# Altium schematic sheet Main.SchDoc
size A; SheetNumber: 1; SheetTotal: 3
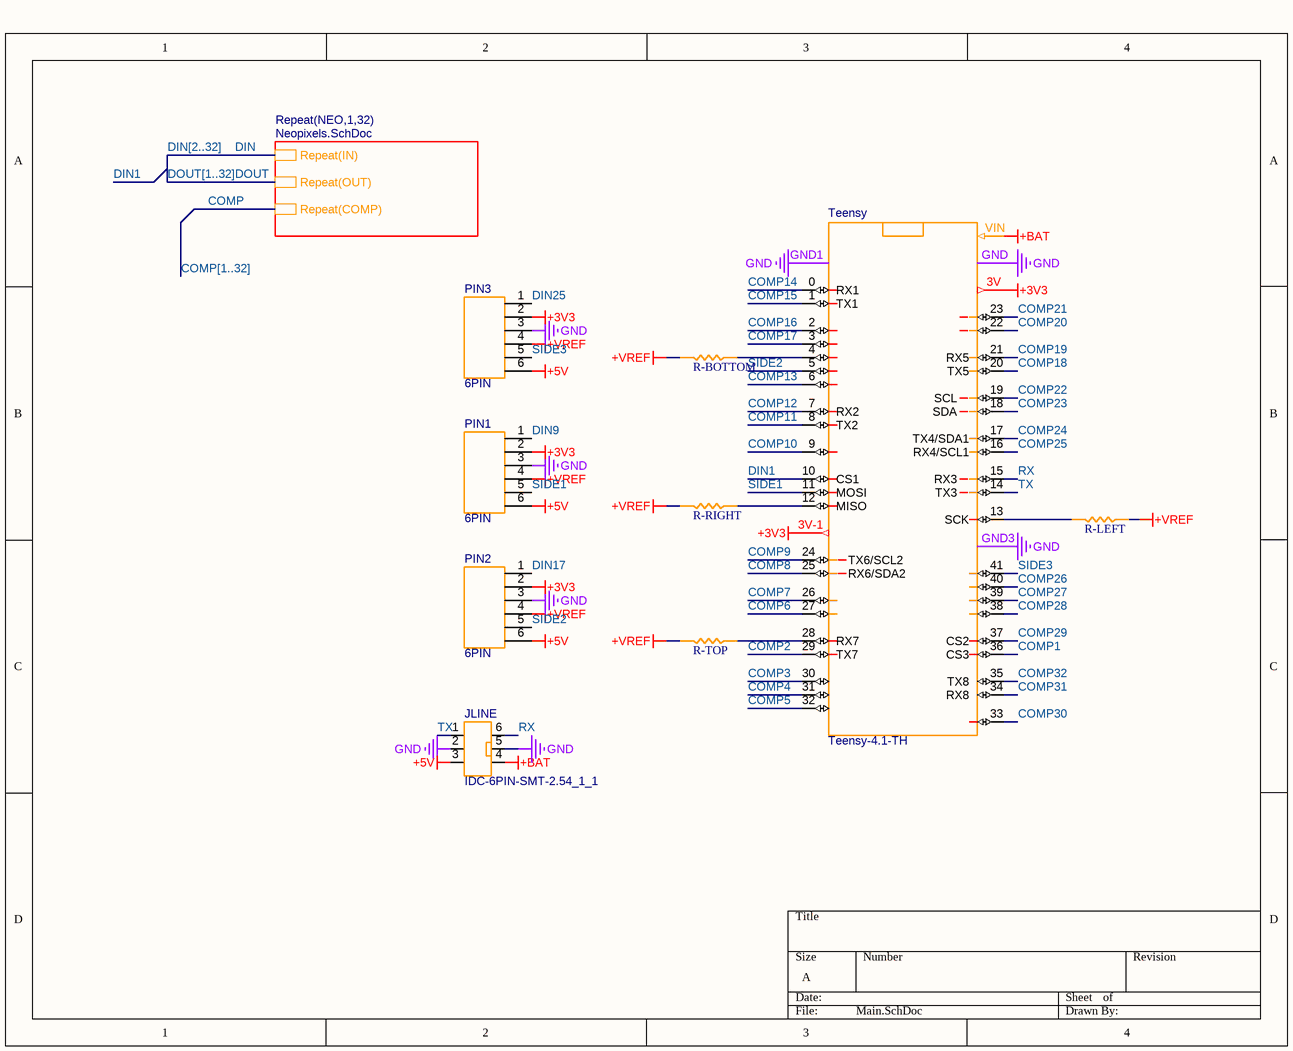
[diagram p0: Main.SchDoc]

## Parts
JLINE  IDC-6PIN-SMT-2.54_1_1  [IDC-6PIN-SMT-2.54]
PIN1  6PIN  [6PIN]
PIN2  6PIN  [6PIN]
PIN3  6PIN  [6PIN]
R-BOTTOM  RES_0603  [RES_0603]  (value not drawn)
R-LEFT  RES_0603  [RES_0603]  (value not drawn)
R-RIGHT  RES_0603  [RES_0603]  (value not drawn)
R-TOP  RES_0603  [RES_0603]  (value not drawn)
Teensy  Teensy-4.1-TH  [Teensy-4.1-TH]

## Sub-sheets
Repeat(NEO,1,32) = Neopixels.SchDoc: Repeat(IN), Repeat(OUT), Repeat(COMP)

## Nets
+3V3: PIN1.2 PIN2.2 PIN3.2 Teensy.3V Teensy.3V-1
+5V: JLINE.3 PIN1.6 PIN2.6 PIN3.6
+BAT: JLINE.4 Teensy.VIN
+VREF: PIN1.4 PIN2.4 PIN3.4 R-BOTTOM.1 R-LEFT.2 R-RIGHT.1 R-TOP.1
GND: JLINE.2 JLINE.5 PIN1.3 PIN2.3 PIN3.3 Teensy.GND Teensy.GND1 Teensy.GND3
COMP: sheet Repeat(NEO,1,32)/Repeat(COMP)
COMP1: Teensy.36(CS3)
COMP2: Teensy.29(TX7)
COMP3: Teensy.30
COMP4: Teensy.31
COMP5: Teensy.32
COMP6: Teensy.27
COMP7: Teensy.26
COMP8: Teensy.25(RX6/SDA2)
COMP9: Teensy.24(TX6/SCL2)
COMP10: Teensy.9
COMP11: Teensy.8(TX2)
COMP12: Teensy.7(RX2)
COMP13: Teensy.6
COMP14: Teensy.0(RX1)
COMP15: Teensy.1(TX1)
COMP16: Teensy.2
COMP17: Teensy.3
COMP18: Teensy.20(TX5)
COMP19: Teensy.21(RX5)
COMP20: Teensy.22
COMP21: Teensy.23
COMP22: Teensy.19(SCL)
COMP23: Teensy.18(SDA)
COMP24: Teensy.17(TX4/SDA1)
COMP25: Teensy.16(RX4/SCL1)
COMP26: Teensy.40
COMP27: Teensy.39
COMP28: Teensy.38
COMP29: Teensy.37(CS2)
COMP30: Teensy.33
COMP31: Teensy.34(RX8)
COMP32: Teensy.35(TX8)
DIN: sheet Repeat(NEO,1,32)/Repeat(IN)
DIN1: Teensy.10(CS1)
DIN9: PIN1.1
DIN17: PIN2.1
DIN25: PIN3.1
DOUT: sheet Repeat(NEO,1,32)/Repeat(OUT)
RX: JLINE.6 Teensy.15(RX3)
SIDE1: PIN1.5 Teensy.11(MOSI)
SIDE2: PIN2.5 Teensy.5
SIDE3: PIN3.5 Teensy.41
TX: JLINE.1 Teensy.14(TX3)
NetR-BOTTOM_2: R-BOTTOM.2 Teensy.4
NetR-LEFT_1: R-LEFT.1 Teensy.13(SCK)
NetR-RIGHT_2: R-RIGHT.2 Teensy.12(MISO)
NetR-TOP_2: R-TOP.2 Teensy.28(RX7)

## Buses and harness runs
bus COMP[1..32]
bus DIN[2..32] = DOUT[1..32]

## Library data of the parts
R-BOTTOM R-LEFT R-RIGHT R-TOP = CMP-009-00178-1: Resistor SMD 0603 generic; Component Type: Standard; Pins: 2; Design Item ID: RES_0603; Source: GenericRC.SchLib